# EAGLE design Verbinder_jr1 (EAGLE 7.6.0)
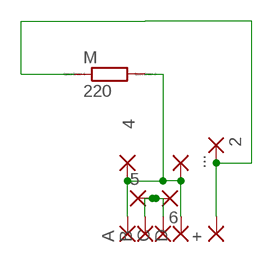
[diagram p0: schematic, sheet 1]

## Parts
2  SMD2  [SMD1,27-2,54]
4  SMD2  [SMD1,27-2,54]
5  SMD2  [SMD1,27-2,54]
6  SMD2  [SMD1,27-2,54]
+  SMD2  [SMD1,27-2,54]
...  SMD2  [SMD1,27-2,54]
A  SMD2  [SMD1,27-2,54]
B  SMD2  [SMD1,27-2,54]
C  SMD2  [SMD1,27-2,54]
D  SMD2  [SMD1,27-2,54]
M  220  R0204/7  [0204/7]

## Nets
N$2: 2.1(P) +.1(P) M.1
N$3: 4.1(P) ....1(P) A.1(P) D.1(P) M.2
N$4: 5.1(P) 6.1(P) B.1(P) C.1(P)

## Library data of the parts
2 4-6 + ... A B C D = wirepad:SMD2: SMD PAD
M = eagle-ltspice:R: RESISTOR, European symbol; SPICEMODEL: NONE; SPICEPREFIX: R

## Board
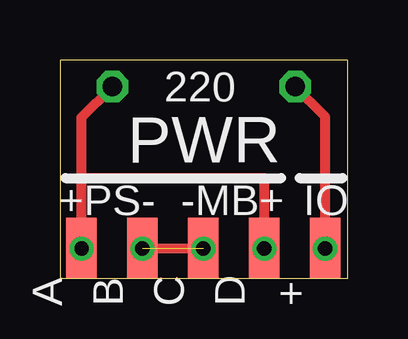
[diagram p1: board, top side]
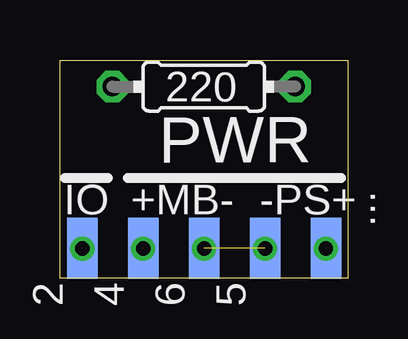
[diagram p2: board, bottom side, seen from below]

Size 12 x 9.1 mm. Coordinates in mm from the lower left corner, seen from the top.
Outline: 0,0 12,0 12,9.1 0,9.1 0,0
Copper layers (1*16): Top 0.035mm / dielectric 1.5mm / Bottom 0.035mm
Design rules "default": minimum track width 10mil, minimum drill 24mil, track to track 8mil, track to pad 8mil, pad to pad 8mil, via to via 8mil, smd to smd 8mil, copper to edge 40mil, drill to drill 8mil, minimum pad ring 10mil, minimum via ring 8mil, stop-mask expansion 4mil, vias tented up to drill 0mil, thermal gap 10mil

### Footprints (pad centres in the part's own frame; a part is rotated, then mirrored left to right if it is on the bottom)
SMD1,27-2,54 = smd 1.27 x 2.54: 1 0,0
0204/7 = drill 0.813 octagon: 1 -3.81,0; 2 3.81,0

### Placement (x,y rotation side)
2  11.06,1.25 0 bottom
4  8.53,1.25 0 bottom
5  3.45,1.25 0 bottom
6  5.99,1.25 0 bottom
+  11.06,1.25 0 top
...  0.91,1.25 180 bottom
A  0.91,1.25 0 top
B  3.45,1.25 0 top
C  5.99,1.25 0 top
D  8.53,1.25 0 top
M  6,7.99 0 bottom

### Tracks (layer width: path | path; a pad name or v marks a point on that pad's centre or on a via)
N$2  (via drill 0.6)  (1 unrouted)
  Top 0.406: 2.1 v11.06,1.24 11.06,6.73 M.1
N$3  (via drill 0.6)  (2 unrouted)
  Top 0.406: v0.91,1.24 ....1 0.91,4.18 | v8.53,1.24 4.1 8.53,4.18 0.91,4.18 | 0.91,4.18 0.91,6.71 M.2
N$4  (2 unrouted)
  Top 0.406: 5.1 6.1
N$8  (via drill 0.6)
  other vias: 3.45,1.24
N$9  (via drill 0.6)
  other vias: 5.99,1.24

### Text on the board
tNames: 220 | PWR | +PS- | -MB+ | IO
bNames: 220 | PWR | -PS+ | +MB- | IO